# Altium project PCB_Project.PrjPcb
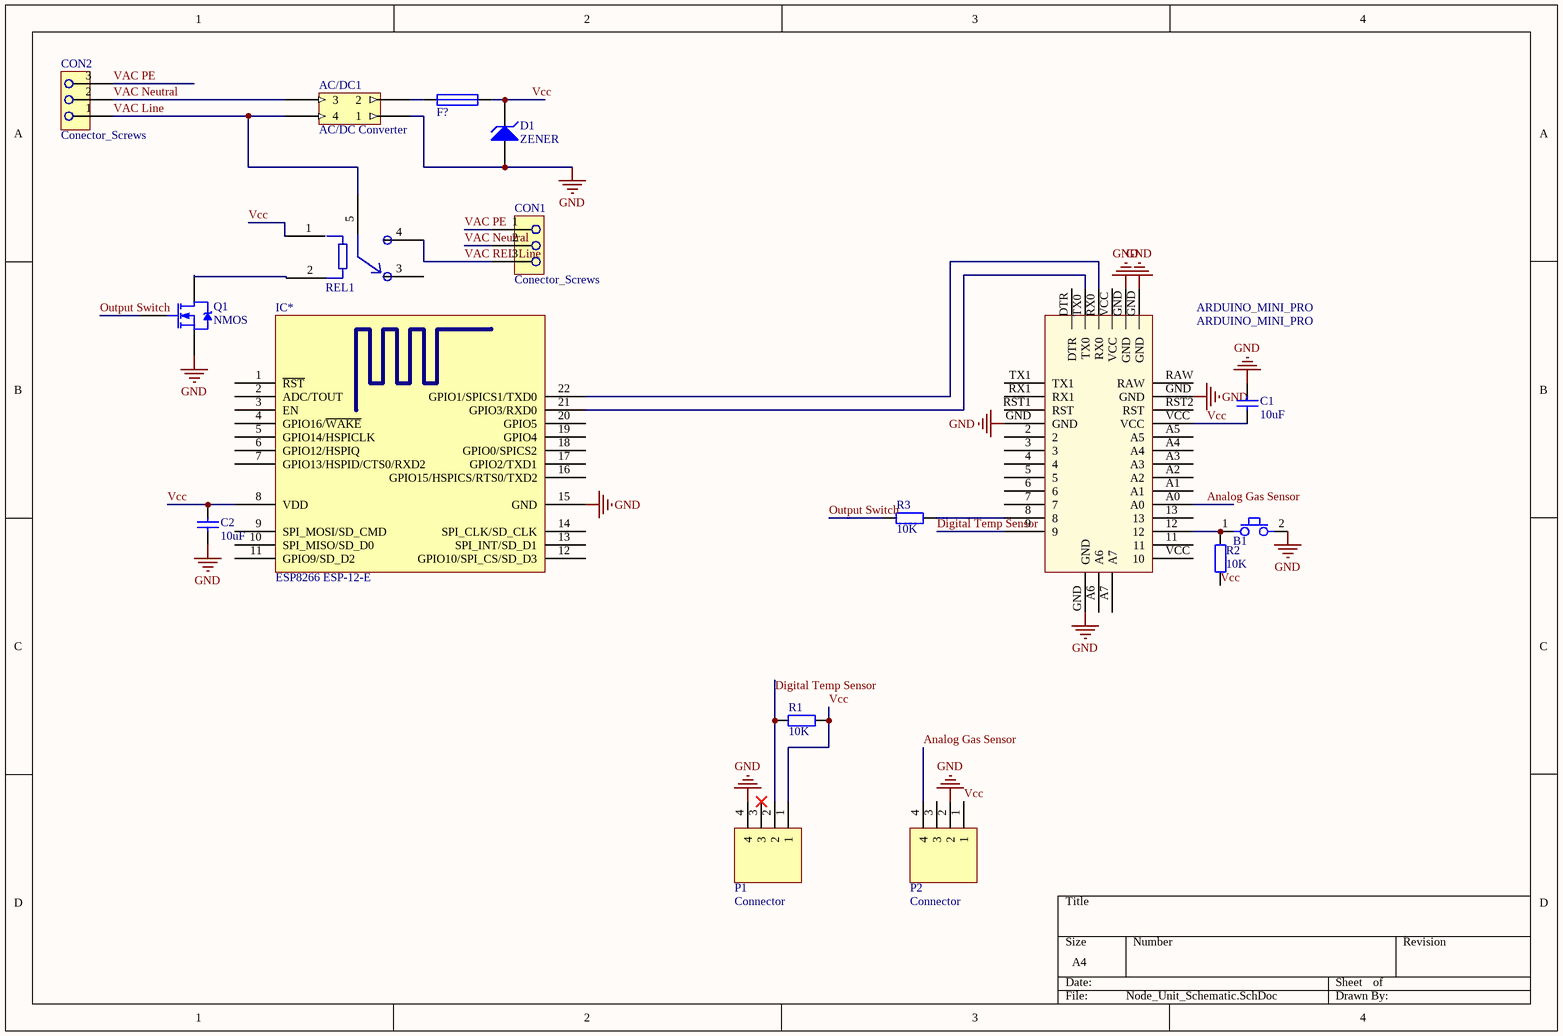
[diagram p0: Node_Unit_Schematic.SchDoc]
1 sheet, 17 parts. Net scope: global (net labels, ports and power ports of the same name join across sheets).
Board file: Node_Unit_Board.PcbDoc

## Sheet Node_Unit_Schematic.SchDoc
size A4

### Parts
AC/DC1  AC/DC Converter  [AC/DC Converter]
ARDUINO_MINI_PRO  ARDUINO_MINI_PRO  [ARDUINO_MINI_PRO]
B1  Button small  [FP_BTN_SMD_3x6]  (value not drawn)
C1  10uF  [FP_0805_CAP_085]
C2  10uF  [FP_0805_CAP_085]
CON1  Conector_Screws  [Serial_Connector]
CON2  Conector_Screws  [Serial_Connector]
D1  ZENER  [FP_SMA]
F?  Multifuse  [FP_1812_MULTIFUSE]  (value not drawn)
IC*  ESP8266 ESP-12-E  [ESP8266 ESP-12-E]
P1  Connector  [FP_CONN4_TUSKE_2MM]
P2  Connector  [FP_CONN4_TUSKE_2MM]
Q1  NMOS  [FP_SOT223]
R1  10K  [FP_0805_RES]
R2  10K  [FP_0805_RES]
R3  10K  [FP_0805_RES]
REL1  Power Relay 3VDC  [PowerRelay 3V]  (value not drawn)

### Nets
GND: AC/DC1.1 ARDUINO_MINI_PRO.GND B1.2 C1.2 C2.2 D1.1(A) IC*.15(GND) P1.4 P2.2 Q1.3(S)
Analog Gas Sensor: ARDUINO_MINI_PRO.A0 P2.4
Digital Temp Sensor: ARDUINO_MINI_PRO.9 P1.2 R1.1
Output Switch: Q1.1(G) R3.1
VAC Line: AC/DC1.4 CON2.1 REL1.5
VAC Neutral: AC/DC1.3 CON1.2 CON2.2
VAC PE: CON1.1 CON2.3
VAC REL Line: CON1.3 REL1.4
Vcc: ARDUINO_MINI_PRO.VCC C1.1 C2.1 D1.2(K) F?.2 IC*.8(VDD) P1.1 P2.1 R1.2 R2.1 REL1.1
NetAC/DC1_2: AC/DC1.2 F?.1
NetARDUINO_MINI_PRO_8: ARDUINO_MINI_PRO.8 R3.2
NetARDUINO_MINI_PRO_12: ARDUINO_MINI_PRO.12 B1.1 R2.2
NetARDUINO_MINI_PRO_RX0: ARDUINO_MINI_PRO.RX0 IC*.22(GPIO1/SPICS1/TXD0)
NetARDUINO_MINI_PRO_TX0: ARDUINO_MINI_PRO.TX0 IC*.21(GPIO3/RXD0)
NetQ1_2: Q1.2(D) REL1.2

Not connected (* = marked no-connect by the designer): ARDUINO_MINI_PRO 2 3 4 5 6 7 11 13 A1 A2 A3 A4 A5 A6 A7 DTR RAW RST1(RST) RST2(RST) RX1 TX1; IC* 1(~{RST}) 2(ADC/TOUT) 3(EN) 4(GPIO16/~{WAKE}) 5(GPIO14/HSPICLK) 6(GPIO12/HSPIQ) 7(GPIO13/HSPID/CTS0/RXD2) 9(SPI_MOSI/SD_CMD) 10(SPI_MISO/SD_D0) 11(GPIO9/SD_D2) 12(GPIO10/SPI_CS/SD_D3) 13(SPI_INT/SD_D1) 14(SPI_CLK/SD_CLK) 16(GPIO15/HSPICS/RTS0/TXD2) 17(GPIO2/TXD1) 18(GPIO0/SPICS2) 19(GPIO4) 20(GPIO5); P1 3*; P2 3; REL1 3

### Library data of the parts
AC/DC1 = AC/DC Converter: Reference: 2401019; Name: VTX-214-001-103; Supplier: Farnell
B1 = Button small: Push button
C1 C2 = CAP 10uF: Capacitor; Tolerance: 10%; Voltage: 16V; Reference: 2320856; Name: SMD Multilayer Ceramic Capacitor, 0805; Supplier: Farnell; Value: 10uF
CON1 CON2 = Conector_Screws: Name: SORKAPOCS 3 P RM5.00 CZM5/3 (STE) 1mmř 13.5A; Reference: 43-06-55; Supplier: Lomex
D1 = ZENER: Zener Diode; U_Z: 24; Reference: 1827607; Name: LITTELFUSE  SMAJ5.0A  TVS Diode, TRANSZORB SMAJ Series, Unidirectional, 5 V, 9.2 V, DO-214AC, 2 Pins; Supplier: Farnell
F? = Multifuse: 1812 Multifuse; Reference: 1597004; Name: PPTC Resettable Fuse, SMD, POLYFUSE 1812L; Supplier: Farnell
P1 P2 = Connector_4pin: 4pin Connector
Q1 = NMOS: NXP - BSP030,115 - MOSFET, N CH, 30V, 10A, SOT223; Reference: 1510761; Name: MOSFET Transistor, N Channel, 300mA, 60V, 2.8 ohm, 10V, 2V; Supplier: Farnell
R1-R3 = RES 10K: Resistor; Tolerance: 5%; Power: 125mW; Name: YAGEO (PHYCOMP)  RC0805JR-0710KL  SMD Chip Resistor, Thick Film, 10 kohm; Reference: 9234136; Supplier: Farnell; Value: 10K
REL1 = Power Relay 3VDC: Name: PE014F03 -  General Purpose Relay; Reference: 2060774; Supplier: Farnell